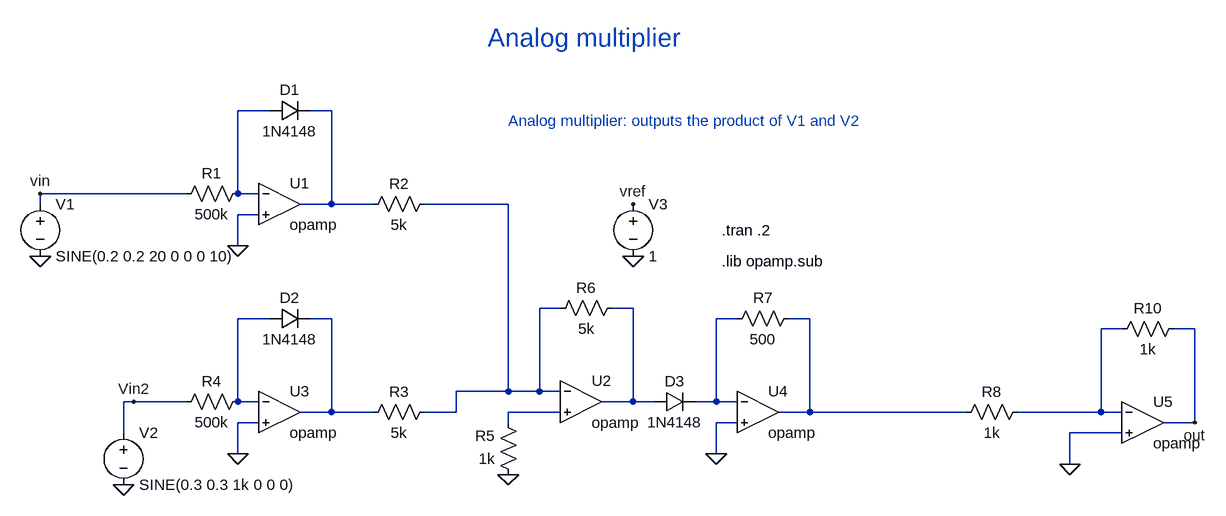
[diagram p0: schematic v1.0.asc]
v1.0.asc, the LTspice schematic file:
Version 4.1
SHEET 1 1636 952
WIRE 160 32 112 32
WIRE 256 32 224 32
WIRE 32 160 -192 160
WIRE 112 160 112 32
WIRE 144 160 112 160
WIRE -192 176 -192 160
WIRE 256 176 256 32
WIRE 256 176 208 176
WIRE 320 176 256 176
WIRE 528 176 400 176
WIRE 144 192 112 192
WIRE 112 240 112 192
WIRE 608 336 576 336
WIRE 720 336 688 336
WIRE 160 352 112 352
WIRE 256 352 224 352
WIRE 880 352 848 352
WIRE 992 352 960 352
WIRE 1472 368 1440 368
WIRE 1584 368 1552 368
WIRE 528 464 528 176
WIRE 528 464 448 464
WIRE 576 464 576 336
WIRE 576 464 528 464
WIRE 608 464 576 464
WIRE -48 480 -64 480
WIRE 32 480 -48 480
WIRE 112 480 112 352
WIRE 144 480 112 480
WIRE 720 480 720 336
WIRE 720 480 672 480
WIRE 752 480 720 480
WIRE 848 480 848 352
WIRE 848 480 816 480
WIRE 880 480 848 480
WIRE 256 496 256 352
WIRE 256 496 208 496
WIRE 320 496 256 496
WIRE 448 496 448 464
WIRE 448 496 400 496
WIRE 608 496 528 496
WIRE 992 496 992 352
WIRE 992 496 944 496
WIRE 1232 496 992 496
WIRE 1440 496 1440 368
WIRE 1440 496 1312 496
WIRE 1472 496 1440 496
WIRE 144 512 112 512
WIRE 528 512 528 496
WIRE 880 512 848 512
WIRE 1584 512 1584 368
WIRE 1584 512 1536 512
WIRE -64 528 -64 480
WIRE 1472 528 1392 528
WIRE 112 560 112 512
WIRE 848 560 848 512
WIRE 1392 576 1392 528
FLAG -192 256 0
FLAG 112 240 0
FLAG 112 560 0
FLAG 528 592 0
FLAG 848 560 0
FLAG -192 160 vin
FLAG -64 608 0
FLAG -48 480 Vin2
FLAG 1392 576 0
FLAG 1584 512 out
FLAG 720 256 0
FLAG 720 176 vref
SYMBOL Opamps\\opamp 176 112 R0
SYMATTR InstName U1
SYMBOL voltage -192 160 R0
WINDOW 123 0 0 Left 2
WINDOW 39 0 0 Left 2
SYMATTR InstName V1
SYMATTR Value SINE(0.2 0.2 20 0 0 0 10)
SYMBOL res 128 144 R90
WINDOW 0 0 56 VBottom 2
WINDOW 3 32 56 VTop 2
SYMATTR InstName R1
SYMATTR Value 500k
SYMBOL diode 160 48 R270
WINDOW 0 32 32 VTop 2
WINDOW 3 0 32 VBottom 2
SYMATTR InstName D1
SYMATTR Value 1N4148
SYMBOL Opamps\\opamp 176 432 R0
SYMATTR InstName U3
SYMBOL res 128 464 R90
WINDOW 0 0 56 VBottom 2
WINDOW 3 32 56 VTop 2
SYMATTR InstName R4
SYMATTR Value 500k
SYMBOL res 416 160 R90
WINDOW 0 0 56 VBottom 2
WINDOW 3 32 56 VTop 2
SYMATTR InstName R2
SYMATTR Value 5k
SYMBOL res 416 480 R90
WINDOW 0 0 56 VBottom 2
WINDOW 3 32 56 VTop 2
SYMATTR InstName R3
SYMATTR Value 5k
SYMBOL res 544 608 R180
WINDOW 0 36 76 Left 2
WINDOW 3 36 40 Left 2
SYMATTR InstName R5
SYMATTR Value 1k
SYMBOL Opamps\\opamp 640 416 R0
SYMATTR InstName U2
SYMBOL res 704 320 R90
WINDOW 0 0 56 VBottom 2
WINDOW 3 32 56 VTop 2
SYMATTR InstName R6
SYMATTR Value 5k
SYMBOL Opamps\\opamp 912 432 R0
SYMATTR InstName U4
SYMBOL res 976 336 R90
WINDOW 0 0 56 VBottom 2
WINDOW 3 32 56 VTop 2
SYMATTR InstName R7
SYMATTR Value 500
SYMBOL res 1328 480 R90
WINDOW 0 0 56 VBottom 2
WINDOW 3 32 56 VTop 2
SYMATTR InstName R8
SYMATTR Value 1k
SYMBOL Opamps\\opamp 1504 448 R0
SYMATTR InstName U5
SYMBOL res 1568 352 R90
WINDOW 0 0 56 VBottom 2
WINDOW 3 32 56 VTop 2
SYMATTR InstName R10
SYMATTR Value 1k
SYMBOL diode 160 368 R270
WINDOW 0 32 32 VTop 2
WINDOW 3 0 32 VBottom 2
SYMATTR InstName D2
SYMATTR Value 1N4148
SYMBOL diode 752 496 R270
WINDOW 0 32 32 VTop 2
WINDOW 3 0 32 VBottom 2
SYMATTR InstName D3
SYMATTR Value 1N4148
SYMBOL voltage -64 512 R0
WINDOW 123 0 0 Left 2
WINDOW 39 0 0 Left 2
SYMATTR InstName V2
SYMATTR Value SINE(0.3 0.3 1k 0 0 0)
SYMBOL voltage 720 160 R0
WINDOW 123 0 0 Left 2
WINDOW 39 0 0 Left 2
SYMATTR InstName V3
SYMATTR Value 1
TEXT 856 264 Left 2 !.lib opamp.sub
TEXT 856 216 Left 2 !.tran .2
TEXT 528 48 Left 2 ;Analog multiplier: outputs the product of V1 and V2
TEXT 496 -80 Left 4 ;Analog multiplier

The netlist it stands for:
* v1.0.asc
X§U1 N001 0 N002 opamp Aol=100K GBW=10Meg  ; pins invin noninvin out
V1 vin 0 SINE(0.2 0.2 20 0 0 0 10)
R1 N001 vin 500k
D1 N001 N002 1N4148
X§U3 N005 0 N006 opamp Aol=100K GBW=10Meg  ; pins invin noninvin out
R4 N005 Vin2 500k
R2 N003 N002 5k
R3 N003 N006 5k
R5 0 N010 1k
X§U2 N003 N010 N004 opamp Aol=100K GBW=10Meg  ; pins invin noninvin out
R6 N004 N003 5k
X§U4 N007 0 N008 opamp Aol=100K GBW=10Meg  ; pins invin noninvin out
R7 N008 N007 500
R8 N009 N008 1k
X§U5 N009 0 out opamp Aol=100K GBW=10Meg  ; pins invin noninvin out
R10 out N009 1k
D2 N005 N006 1N4148
D3 N004 N007 1N4148
V2 Vin2 0 SINE(0.3 0.3 1k 0 0 0)
V3 vref 0 1
.model D D
.lib standard.dio
.lib opamp.sub
.tran .2
* Analog multiplier: outputs the product of V1 and V2
* Analog multiplier
.backanno
.end